# Altium project InvTrifasico.PrjPcb
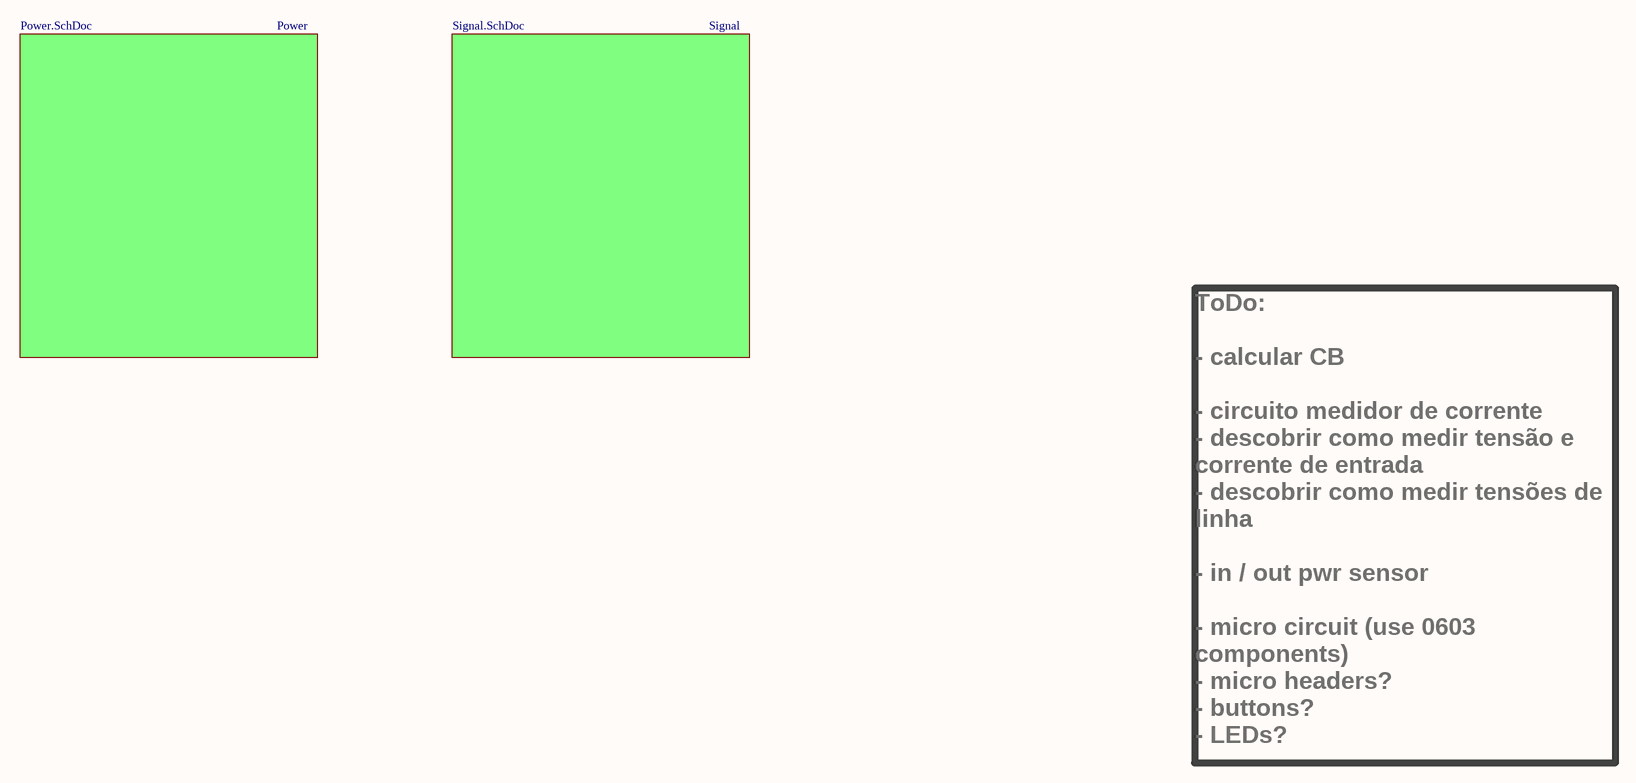
[diagram p0: TopHierarchy.SchDoc]
3 sheets, 79 parts. Net scope: global (net labels, ports and power ports of the same name join across sheets).
Board file: InvTrifasico.PcbDoc
Sheets:
  TopHierarchy.SchDoc
    Power = Power.SchDoc
    Signal = Signal.SchDoc

## Sheet TopHierarchy.SchDoc
size A3

### Sub-sheets
Power = Power.SchDoc: no entries
Signal = Signal.SchDoc: no entries

### Notes on the sheet
- ToDo:
  - calcular CB
  - circuito medidor de corrente
  - descobrir como medir tensão e corrente de entrada
  - descobrir como medir tensões de linha
  - in / out pwr sensor
  - micro circuit (use 0603 components)
  - micro headers?
  - buttons?
  - LEDs?
  - in / out connectors
  - choose heat sink

## Sheet Power.SchDoc
size A3
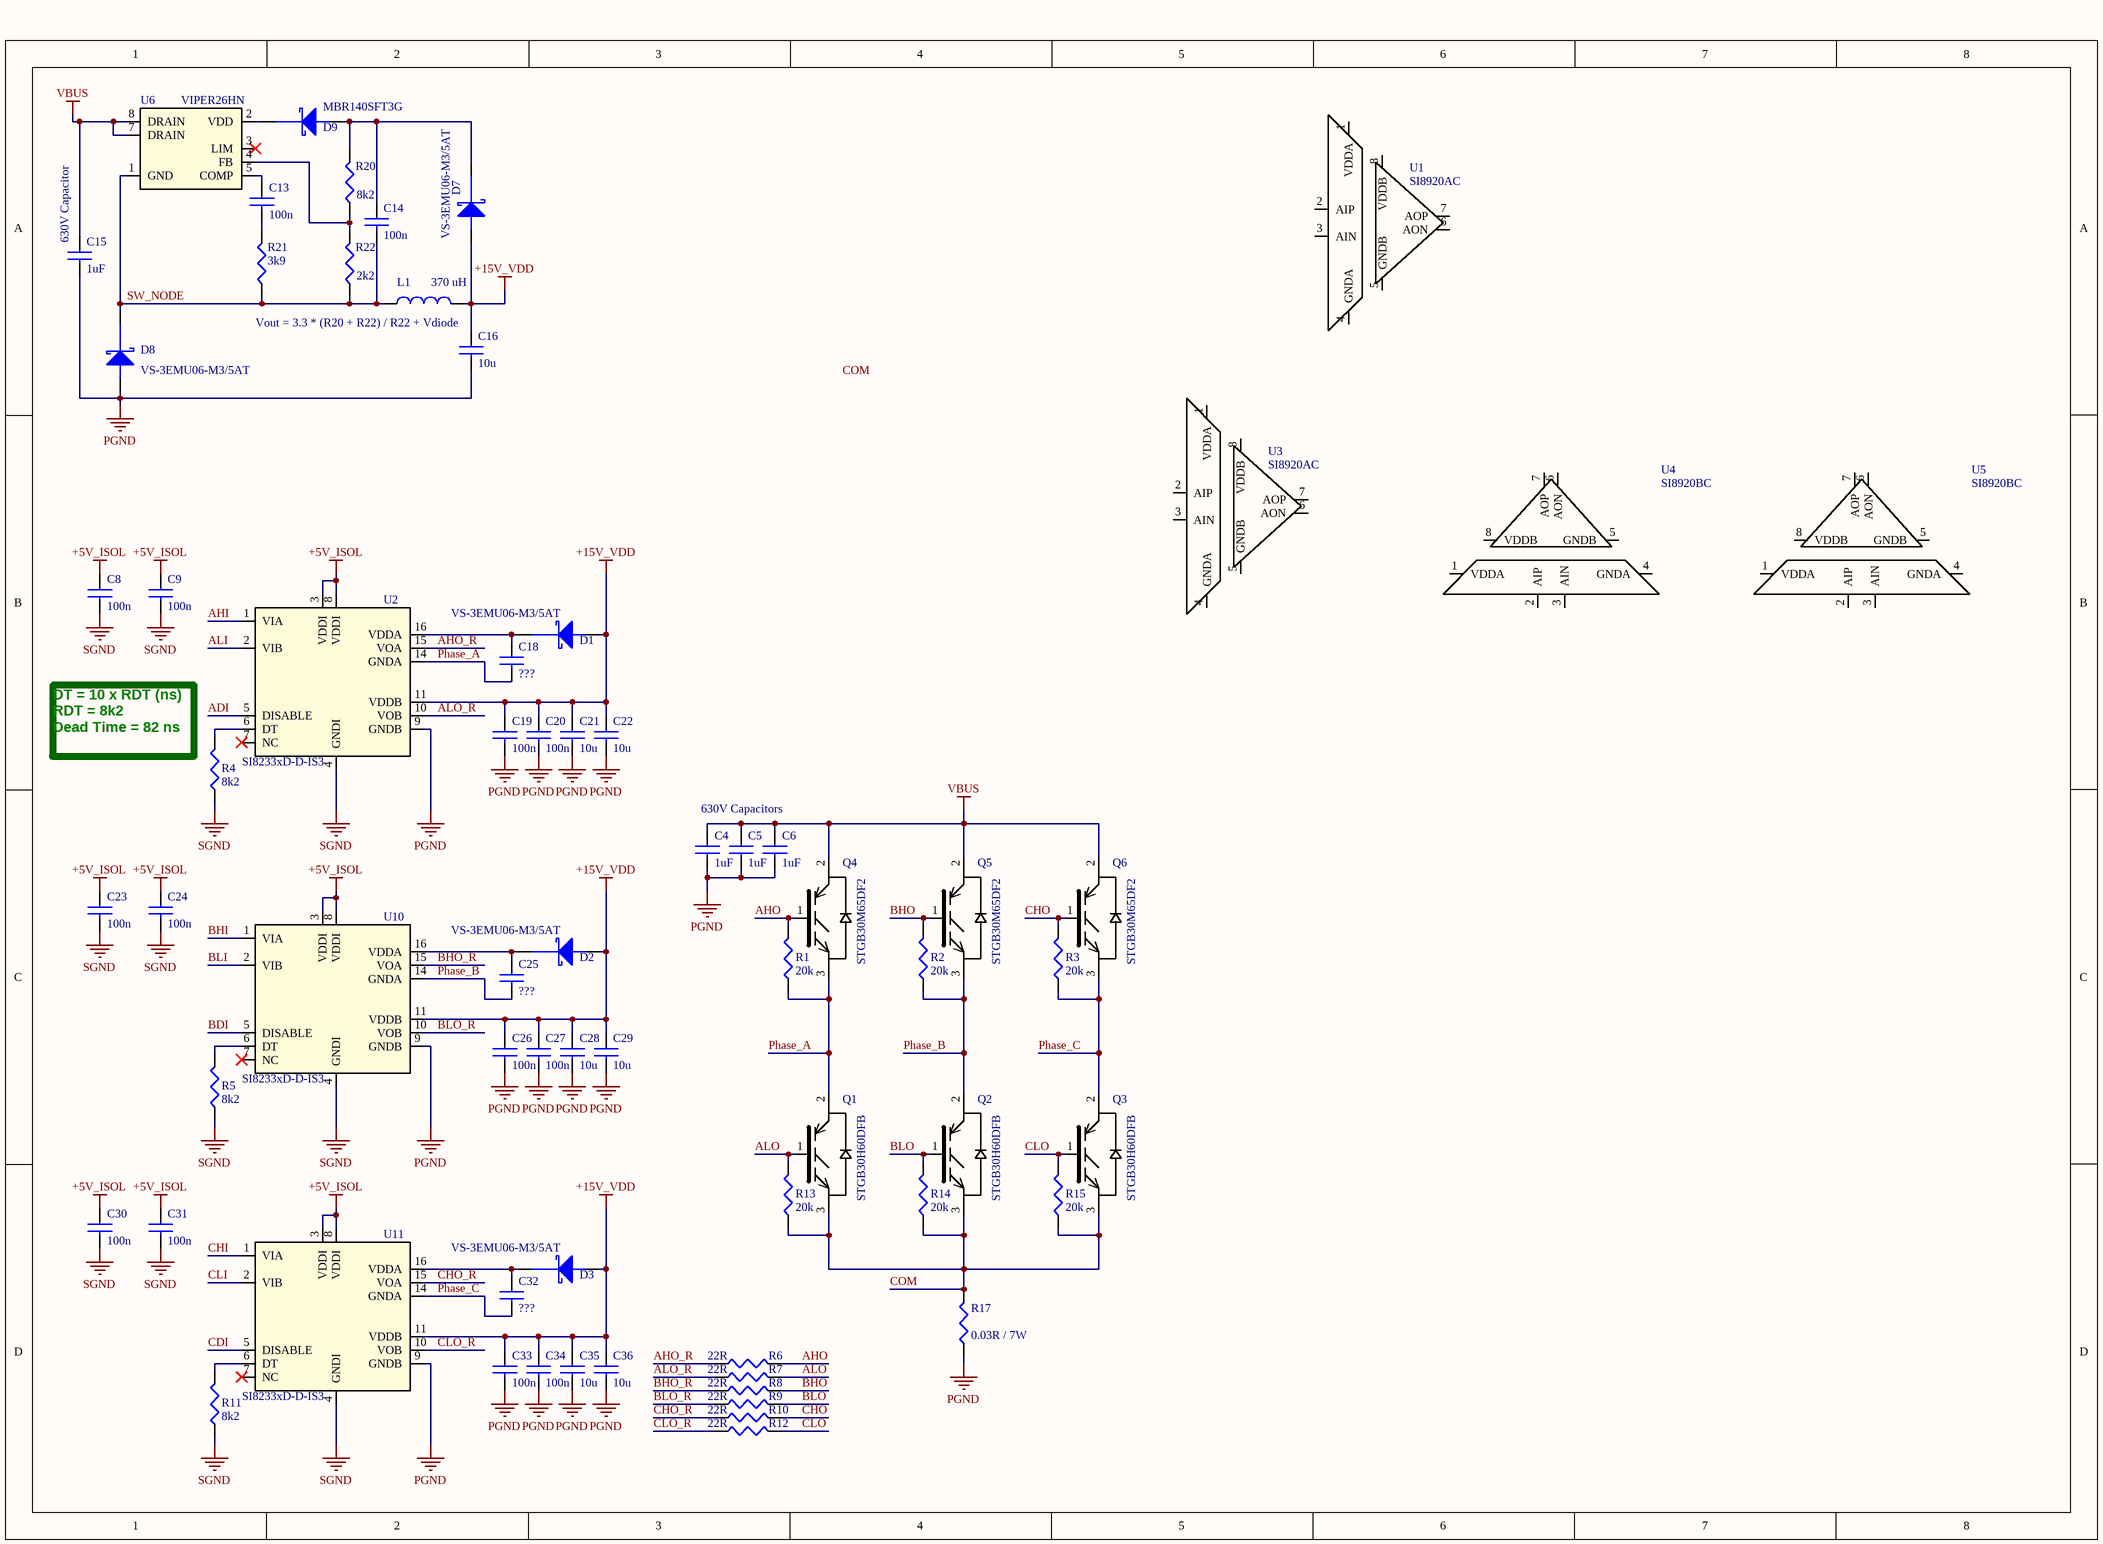
[diagram p1: Power.SchDoc]

### Parts
C4  1uF  [C_HIGH_V]
C5  1uF  [C_HIGH_V]
C6  1uF  [C_HIGH_V]
C8  100n  [C0805]
C9  100n  [C0805]
C13  100n  [C0805]
C14  100n  [C0805]
C15  1uF  [C_HIGH_V]
C16  10u  [C1206]
C18  ???  [C0805]
C19  100n  [C0805]
C20  100n  [C0805]
C21  10u  [C0805]
C22  10u  [C0805]
C23  100n  [C0805]
C24  100n  [C0805]
C25  ???  [C0805]
C26  100n  [C0805]
C27  100n  [C0805]
C28  10u  [C0805]
C29  10u  [C0805]
C30  100n  [C0805]
C31  100n  [C0805]
C32  ???  [C0805]
C33  100n  [C0805]
C34  100n  [C0805]
C35  10u  [C0805]
C36  10u  [C0805]
D1  VS-3EMU06-M3/5AT  [DO-214AC]
D2  VS-3EMU06-M3/5AT  [DO-214AC]
D3  VS-3EMU06-M3/5AT  [DO-214AC]
D7  VS-3EMU06-M3/5AT  [DO-214AC]
D8  VS-3EMU06-M3/5AT  [DO-214AC]
D9  MBR140SFT3G  [SOD-123FL]
L1  370 uH  [IND_370u]
Q1  STGB30H60DFB  [D2PAK]
Q2  STGB30H60DFB  [D2PAK]
Q3  STGB30H60DFB  [D2PAK]
Q4  STGB30M65DF2  [D2PAK]
Q5  STGB30M65DF2  [D2PAK]
Q6  STGB30M65DF2  [D2PAK]
R1  20k  [R0805]
R2  20k  [R0805]
R3  20k  [R0805]
R4  8k2  [R0805]
R5  8k2  [R0805]
R6  22R  [R0805]
R7  22R  [R0805]
R8  22R  [R0805]
R9  22R  [R0805]
R10  22R  [R0805]
R11  8k2  [R0805]
R12  22R  [R0805]
R13  20k  [R0805]
R14  20k  [R0805]
R15  20k  [R0805]
R17  0.03R / 7W  [R2818]
R20  8k2  [R0805]
R21  3k9  [R0805]
R22  2k2  [R0805]
U1  SI8920AC  [8_DIP_SMD]
U2  SI8233xD-D-IS3  [SOIC-16 Wide (14-pins)]
U3  SI8920AC  [8_DIP_SMD]
U4  SI8920BC  [8_DIP_SMD]
U5  SI8920BC  [8_DIP_SMD]
U6  VIPER26HN  [7_DIP]
U10  SI8233xD-D-IS3  [SOIC-16 Wide (14-pins)]
U11  SI8233xD-D-IS3  [SOIC-16 Wide (14-pins)]

### Nets
+5V_ISOL: C8.1 C9.1 C23.1 C24.1 C30.1 C31.1 U2.3(VDDI) U2.8(VDDI) U10.3(VDDI) U10.8(VDDI) U11.3(VDDI) U11.8(VDDI)
+15V_VDD: C16.1 C19.1 C20.1 C21.1 C22.1 C26.1 C27.1 C28.1 C29.1 C33.1 C34.1 C35.1 C36.1 D1.2(Anode) D2.2(Anode) D3.2(Anode) D7.2(Anode) L1.2 U2.11(VDDB) U10.11(VDDB) U11.11(VDDB)
PGND: C4.2 C5.2 C6.2 C15.2 C16.2 C19.2 C20.2 C21.2 C22.2 C26.2 C27.2 C28.2 C29.2 C33.2 C34.2 C35.2 C36.2 D8.2(Anode) R17.1 U2.9(GNDB) U10.9(GNDB) U11.9(GNDB)
SGND: C8.2 C9.2 C23.2 C24.2 C30.2 C31.2 R4.1 R5.1 R11.1 U2.4(GNDI) U10.4(GNDI) U11.4(GNDI)
VBUS: C4.1 C5.1 C6.1 C15.1 Q4.2(DRAIN) Q5.2(DRAIN) Q6.2(DRAIN) U6.7(DRAIN) U6.8(DRAIN)
ADI: U2.5(DISABLE)
AHI: U2.1(VIA)
AHO: Q4.1(GATE) R1.2 R6.2
AHO_R: R6.1 U2.15(VOA)
ALI: U2.2(VIB)
ALO: Q1.1(GATE) R7.2 R13.2
ALO_R: R7.1 U2.10(VOB)
BDI: U10.5(DISABLE)
BHI: U10.1(VIA)
BHO: Q5.1(GATE) R2.2 R8.2
BHO_R: R8.1 U10.15(VOA)
BLI: U10.2(VIB)
BLO: Q2.1(GATE) R9.2 R14.2
BLO_R: R9.1 U10.10(VOB)
CDI: U11.5(DISABLE)
CHI: U11.1(VIA)
CHO: Q6.1(GATE) R3.2 R10.2
CHO_R: R10.1 U11.15(VOA)
CLI: U11.2(VIB)
CLO: Q3.1(GATE) R12.2 R15.2
CLO_R: R12.1 U11.10(VOB)
COM: Q1.3(SOURCE) Q2.3(SOURCE) Q3.3(SOURCE) R13.1 R14.1 R15.1 R17.2
Phase_A: C18.2 Q1.2(DRAIN) Q4.3(SOURCE) R1.1 U2.14(GNDA)
Phase_B: C25.2 Q2.2(DRAIN) Q5.3(SOURCE) R2.1 U10.14(GNDA)
Phase_C: C32.2 Q3.2(DRAIN) Q6.3(SOURCE) R3.1 U11.14(GNDA)
SW_NODE: C14.2 D8.1(Cathode) L1.1 R21.1 R22.1 U6.1(GND)
NetC13_1: C13.1 U6.5(COMP)
NetC13_2: C13.2 R21.2
NetC14_1: C14.1 D7.1(Cathode) D9.2(Anode) R20.2
NetC18_1: C18.1 D1.1(Cathode) U2.16(VDDA)
NetC25_1: C25.1 D2.1(Cathode) U10.16(VDDA)
NetC32_1: C32.1 D3.1(Cathode) U11.16(VDDA)
NetD9_1: D9.1(Cathode) U6.2(VDD)
NetR4_2: R4.2 U2.6(DT)
NetR5_2: R5.2 U10.6(DT)
NetR11_2: R11.2 U11.6(DT)
NetR20_1: R20.1 R22.2 U6.4(FB)

Not connected (* = marked no-connect by the designer): U1 1(VDDA) 2(AIP) 3(AIN) 4(GNDA) 5(GNDB) 6(AON) 7(AOP) 8(VDDB); U2 7(NC)*; U3 1(VDDA) 2(AIP) 3(AIN) 4(GNDA) 5(GNDB) 6(AON) 7(AOP) 8(VDDB); U4 1(VDDA) 2(AIP) 3(AIN) 4(GNDA) 5(GNDB) 6(AON) 7(AOP) 8(VDDB); U5 1(VDDA) 2(AIP) 3(AIN) 4(GNDA) 5(GNDB) 6(AON) 7(AOP) 8(VDDB); U6 3(LIM)*; U10 7(NC)*; U11 7(NC)*

### Notes on the sheet
- (near C15) 630V Capacitor
- Vout = 3.3 * (R20 + R22) / R22 + Vdiode
- (near R4) DT = 10 x RDT (ns)
  RDT = 8k2
  Dead Time = 82 ns
- 630V Capacitors
- Labels drawn without touching a wire or pin: COM

### Library data of the parts
C4-C6 C15 = CAP_HIGH_VOLAGE: CAP CER 1UF 630V X7T STACKED SMD; Manufacturer: Murata Electronics North America; Manufacturer Part Number: KC355TD7LQ105MV01K; Tolerance: ±20%; Supplier 1: Digi-Key; RoHS: RoHS Compliant; Category: Capacitors; Stock 1: 0; Pricing 1: 1000=1.78126 (USD); Packaging: Tape & Reel (TR); Part Status: Active; Voltage - Rated: 630V; Temperature Coefficient: X7T; Operating Temperature: -55°C ~ 125°C; Features: -; Ratings: AEC-Q200; Applications: Automotive; Failure Rate: -; Mounting Type: Surface Mount, MLCC; Package / Case: Stacked SMD, 2 J-Lead; Size / Dimension: 0.240" L x 0.209" W (6.10mm x 5.30mm); Height - Seated (Max): -; Thickness (Max): 0.197" (5.00mm); Lead Spacing: -; Lead Style: J-Lead; ComponentLink1URL: http://search.murata.co.jp/Ceramy/image/img/A01X/G101/ENG/KC355_V01_E.pdf; ComponentLink1Description: http://search.murata.co.jp/Ceramy/image/img/A01X/G101/ENG/KC355_V01_E.pdf; Supplier Part Number 1: KC355TD7LQ105MV01K-ND
C8 C9 C13 C14 C18-C36 = CAP_0805: 0805 Capacitor
C16 = CAP_1206_10u: CAP CER 10UF 35V X5R 1206; Manufacturer: Murata; Tolerance: ±20%; Supplier 1: Arrow; Category: Capacitors; Voltage - Rated: 35V; Temperature Coefficient: X5R; Mounting Type: Surface Mount, MLCC; Operating Temperature: -55°C ~ 85°C; Package / Case: 1206 (3216 Metric); Size/Dimension: 0.126" L x 0.063" W (3.20mm x 1.60mm); Packaging: Tape & Reel (TR); Supplier 2: Digi-Key; Supplier 1 Part Number: GRM319R6YA106MA12D; Supplier 2 Part Number: 490-9965-2-ND
D1-D3 D7 D8 = VS-3EMU06-M3/5AT: DIODE GEN PURP 600V 3A DO214AC; Manufacturer: Vishay Semiconductor Diodes Division; Diode Type: Standard; Speed: Fast Recovery =< 500ns, > 200mA (Io); Supplier 1: Digi-Key; Manufacturer Part Number: VS-3EMU06-M3/5AT; RoHS: RoHS Compliant; Category: Discrete Semiconductor Products; Stock 1: 0; Pricing 1: 1=0.44, 10=0.374, 25=0.3492, 100=0.2795, 250=0.25956, 500=0.21962, 1000=0.1697, 2500=0.15473 (USD); Packaging: Cut Tape (CT); Part Status: Active; Current - Average Rectified (Io): 3A; Capacitance @ Vr, F: -; Mounting Type: Surface Mount; Package / Case: DO-214AC, SMA; Supplier Device Package: DO-214AC (SMA); Operating Temperature - Junction: -55°C ~ 175°C; ComponentLink1URL: http://www.vishay.com/docs/93993/vs-3emu06-m3.pdf; ComponentLink1Description: http://www.vishay.com/docs/93993/vs-3emu06-m3.pdf; Supplier Part Number 1: VS-3EMU06-M3/5ATGICT-ND
D9 = MBR140SFT3G: DIODE SCHOTTKY 550mV @ 1A, 40V, SOD123L; Manufacturer: ON Semiconductor; Manufacturer Part Number: MBR140SFT1G; Current - Reverse Leakage @ Vr: 500µA @ 40V; Supplier 2: Digi-Key; Packaging: Cut Tape (CT); Diode Type: Schottky; Voltage - DC Reverse (Vr) (Max): 40V; Current - Average Rectified (Io): 1A; Voltage - Forward (Vf) (Max) @ If: 550mV @ 1A; Mounting Type: Surface Mount; Package / Case: SOD-123F; Supplier Device Package: SOD-123L; Operating Temperature - Junction: -55°C ~ 125°C; Supplier 2 Part Number: MBR140SFT1GOSDKR-ND; Supplier 1: Arrow; Supplier 1 Part Number: MBR140SFT3G
L1 = IND_370u: 390µH Shielded Wirewound Inductor 1.6A 680 mOhm Max Nonstandard; Manufacturer: Bourns Inc.; Manufacturer Part Number: PM127SH-391M-RC; Material - Core: Ferrite; Tolerance: ±20%; Q @ Freq: 20 @ 796kHz; Supplier 1: Digi-Key; RoHS: RoHS Compliant; Category: Inductors, Coils, Chokes; Stock 1: 0; Pricing 1: 400=0.62475 (USD); Packaging: Tape & Reel (TR); Part Status: Active; Type: Wirewound; Shielding: Shielded; DC Resistance (DCR): 680 mOhm Max; Ratings: -; Operating Temperature: -40°C ~ 125°C; Mounting Type: Surface Mount; Package / Case: Nonstandard; Supplier Device Package: -; Size / Dimension: 0.492" L x 0.492" W (12.50mm x 12.50mm); Height - Seated (Max): 0.315" (8.00mm); ComponentLink1URL: http://www.bourns.com/docs/Product-Datasheets/PM127SH_SERIES.pdf; ComponentLink1Description: http://www.bourns.com/docs/Product-Datasheets/PM127SH_SERIES.pdf; Supplier Part Number 1: PM127SH-391M-RC-ND
Q1-Q3 = STGB30H60DFB: TRENCH GATE FIELD-STOP IGBT, HB; Manufacturer: STMicroelectronics; IGBT Type: Trench Field Stop; Vce(on) (Max) @ Vge, Ic: 2V @ 15V, 30A; Switching Energy: 383µJ (on), 293µJ (off); Input Type: Standard; Td (on/off) @ 25°C: 37ns/146ns; Test Condition: 400V, 30A, 10 Ohm, 15V; Supplier 1: Digi-Key; Manufacturer Part Number: STGB30H60DFB; RoHS: RoHS Compliant; Category: Discrete Semiconductor Products; Stock 1: 0; Pricing 1: 1=2.81, 10=2.538, 100=2.0394, 500=1.5862 (USD); Packaging: Cut Tape (CT); Part Status: Active; Operating Temperature: -55°C ~ 175°C (TJ); Mounting Type: Surface Mount; Package / Case: TO-263-3, D²Pak (2 Leads + Tab), TO-263AB; Supplier Device Package: D2PAK; ComponentLink1URL: http://www.st.com/content/ccc/resource/technical/document/datasheet/56/6d/c4/33/3a/aa/4a/fc/DM00125119.pdf/files/DM00125119.pdf/jcr:content/translations/en.DM00125119.pdf; ComponentLink1Description: http://www.st.com/content/ccc/resource/technical/document/datasheet/56/6d/c4/33/3a/aa/4a/fc/DM00125119.pdf/files/DM00125119.pdf/jcr:content/translations/en.DM00125119.pdf; Supplier Part Number 1: 497-16518-1-ND
Q4-Q6 = STGB30M65DF2: IGBT 650V 30A D2PAK; Manufacturer: STMicroelectronics; IGBT Type: Trench Field Stop; Vce(on) (Max) @ Vge, Ic: 2V @ 15V, 30A; Switching Energy: 300µJ (on), 960µJ (off); Input Type: Standard; Td (on/off) @ 25°C: 31.6ns/115ns; Test Condition: 400V, 30A, 10 Ohm, 15V; Supplier 1: Digi-Key; Manufacturer Part Number: STGB30M65DF2; RoHS: RoHS Compliant; Category: Discrete Semiconductor Products; Stock 1: 1013; Pricing 1: 1=4.1, 10=3.681, 100=3.0158, 500=2.56726 (USD); Packaging: Cut Tape (CT); Part Status: Active; Operating Temperature: -55°C ~ 175°C (TJ); Mounting Type: Surface Mount; Package / Case: TO-263-3, D²Pak (2 Leads + Tab), TO-263AB; Supplier Device Package: D2PAK; ComponentLink1URL: http://www.st.com/content/ccc/resource/technical/document/datasheet/f7/d5/65/0d/e4/ad/41/57/DM00157913.pdf/files/DM00157913.pdf/jcr:content/translations/en.DM00157913.pdf; ComponentLink1Description: http://www.st.com/content/ccc/resource/technical/document/datasheet/f7/d5/65/0d/e4/ad/41/57/DM00157913.pdf/files/DM00157913.pdf/jcr:content/translations/en.DM00157913.pdf; Supplier Part Number 1: 497-15843-1-ND
R1-R15 R20-R22 = RES_0805
R17 = res_2818: RES 0.003 OHM 1% 7W 2818; Manufacturer: Vishay Dale; Manufacturer Part Number: WSHM28183L000FEA; Temperature Coefficient: ±200ppm/°C; Supplier 1: Digi-Key; RoHS: RoHS Compliant; Category: Resistors; Stock 1: 954; Pricing 1: 1=1.86, 10=1.652, 25=1.5316, 50=1.4414, 100=1.2613, 250=1.08108, 500=0.9009, 1000=0.78078 (USD); Packaging: Cut Tape (CT); Part Status: Active; Tolerance: ±1%; Power (Watts): 7W; Composition: Metal Element; Features: Automotive AEC-Q200, Current Sense, Moisture Resistant, Pulse Withstanding; Operating Temperature: -65°C ~ 170°C; Package / Case: Nonstandard; Supplier Device Package: 2818; Size / Dimension: 0.280" L x 0.181" W (7.10mm x 4.60mm); Height - Seated (Max): 0.069" (1.75mm); Failure Rate: -; ComponentLink1URL: http://www.vishay.com/docs/30188/wshm2818.pdf; ComponentLink1Description: http://www.vishay.com/docs/30188/wshm2818.pdf; Supplier Part Number 1: 541-2619-1-ND
U1 U3 = SI8920AC: IC OP AMP ISOLATION 8DIP-GW; Manufacturer: Silicon Labs; Manufacturer Part Number: SI8920AC-IP; Output Type: Differential; Current - Supply: 4.2mA; Voltage - Supply, Single/Dual (±): 3 V ~ 5.5 V; Supplier 1: Digi-Key; RoHS: RoHS Compliant; Category: Integrated Circuits (ICs); Stock 1: 595; Pricing 1: 1=3.51, 25=3.3844, 100=3.2544, 1000=3.19789 (USD); Packaging: Tube; Part Status: Active; Amplifier Type: Isolation; Slew Rate: -; Operating Temperature: -40°C ~ 125°C; Mounting Type: Surface Mount; Package / Case: 8-SMD, Gull Wing; Supplier Device Package: 8-DIP Gull Wing; ComponentLink1URL: http://www.silabs.com/documents/public/data-sheets/si8920-datasheet.pdf; ComponentLink1Description: http://www.silabs.com/documents/public/data-sheets/si8920-datasheet.pdf; Supplier Part Number 1: 336-3328-5-ND
U2 U10 U11 = SI8233xD-D-IS3: ISOLATED GATE DRIVER, 8 MM CREEP; Manufacturer: Silicon Labs; Manufacturer Part Number: SI8233AD-D-IS3; Voltage - Isolation: 5000Vrms; Common Mode Transient Immunity (Min): 45kV/µs; Propagation Delay tpLH / tpHL (Max): 60ns, 60ns; Pulse Width Distortion (Max): 5.6ns; Rise / Fall Time (Typ): 12ns, 12ns; Current - Output High, Low: 2A, 4A; Current - Peak Output: 4A; Voltage - Supply: 6.5 V ~ 24 V; Approvals: CQC, CSA, UR, VDE; Supplier 1: Digi-Key; Supplier Part Number 1: 336-4258-ND; RoHS: RoHS Compliant; Category: Isolators; Stock 1: 76; Pricing 1: 1=3.37, 25=3.2436, 100=3.1188, 1000=2.8125 (USD); Packaging: Tube; Part Status: Active; Technology: Capacitive Coupling; Voltage - Forward (Vf) (Typ): -; Operating Temperature: -40°C ~ 125°C; Mounting Type: Surface Mount; Package / Case: 14-SOIC (0.295", 7.50mm Width); Supplier Device Package: 14-SOIC; ComponentLink1URL: https://www.silabs.com/documents/public/data-sheets/Si823x.pdf; ComponentLink1Description: https://www.silabs.com/documents/public/data-sheets/Si823x.pdf
U4 U5 = SI8920BC: IC OP AMP ISOLATION 8DIP-GW; Manufacturer: Silicon Labs; Manufacturer Part Number: SI8920BC-IP; Output Type: Differential; Current - Supply: 4.2mA; Voltage - Supply, Single/Dual (±): 3 V ~ 5.5 V; Supplier 1: Digi-Key; RoHS: RoHS Compliant; Category: Integrated Circuits (ICs); Stock 1: 3602; Pricing 1: 1=2.93, 25=2.8204, 100=2.712, 1000=2.65553 (USD); Packaging: Tube; Part Status: Active; Amplifier Type: Isolation; Slew Rate: -; Operating Temperature: -40°C ~ 125°C; Mounting Type: Surface Mount; Package / Case: 8-SMD, Gull Wing; Supplier Device Package: 8-DIP Gull Wing; ComponentLink1URL: http://www.silabs.com/documents/public/data-sheets/si8920-datasheet.pdf; ComponentLink1Description: http://www.silabs.com/documents/public/data-sheets/si8920-datasheet.pdf; Supplier Part Number 1: 336-3329-5-ND
U6 = VIPER26HN: IC OFFLINE CONV PWM 800V 7-DIP; Manufacturer: STMicroelectronics; Output Isolation: Either; Internal Switch(s): Yes; Topology: Flyback; Voltage - Supply (Vcc/Vdd): 11.5 V ~ 23.5 V; Duty Cycle: 70%; Frequency - Switching: 115kHz; Fault Protection: Current Limiting, Over Temperature; Supplier 1: Digi-Key; Manufacturer Part Number: VIPER26HN; RoHS: RoHS Compliant; Category: Integrated Circuits (ICs); Stock 1: 2903; Pricing 1: 1=1.1, 10=0.979, 100=0.7636, 500=0.6308, 1000=0.498 (USD); Packaging: Tube; Part Status: Active; Voltage - Breakdown: 800V; Control Features: -; Operating Temperature: -40°C ~ 150°C (TJ); Package / Case: 8-DIP (0.300", 7.62mm), 7 Leads; Supplier Device Package: 7-DIP; Mounting Type: Through Hole; Base Part Number: VIPER26; ComponentLink1URL: http://www.st.com/content/ccc/resource/technical/document/datasheet/cd/d4/93/15/03/e1/40/81/CD00279018.pdf/files/CD00279018.pdf/_jcr_content/translations/en.CD00279018.pdf; ComponentLink1Description: http://www.st.com/content/ccc/resource/technical/document/datasheet/cd/d4/93/15/03/e1/40/81/CD00279018.pdf/files/CD00279018.pdf/_jcr_content/translations/en.CD00279018.pdf; Supplier Part Number 1: 497-10743-5-ND

## Sheet Signal.SchDoc
size A3
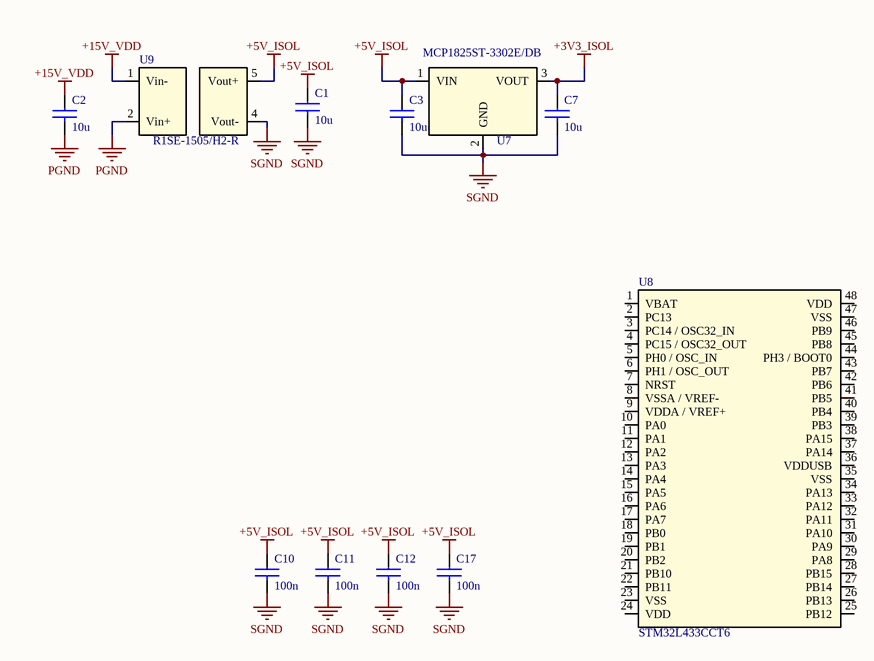
[diagram p2: Signal.SchDoc]

### Parts
C1  10u  [C0805]
C2  10u  [C1206]
C3  10u  [C0805]
C7  10u  [C0805]
C10  100n  [C0805]
C11  100n  [C0805]
C12  100n  [C0805]
C17  100n  [C0805]
U7  MCP1825ST-3302E/DB  [SOT-223-3]
U8  STM32L433CCT6  [LQFP-48]
U9  R1SE-1505/H2-R  [R1SE-1505/H2-R]

### Nets
+3V3_ISOL: C7.1 U7.3(VOUT)
+5V_ISOL: C1.1 C3.1 C10.1 C11.1 C12.1 C17.1 U7.1(VIN) U9.5(Vout+)
+15V_VDD: C2.1 U9.1(Vin-)
PGND: C2.2 U9.2(Vin+)
SGND: C1.2 C3.2 C7.2 C10.2 C11.2 C12.2 C17.2 U7.2(GND) U9.4(Vout-)

Not connected (* = marked no-connect by the designer): U8 1(VBAT) 2(PC13) 3(PC14_/_OSC32_IN) 4(PC15_/_OSC32_OUT) 5(PH0_/_OSC_IN) 6(PH1_/_OSC_OUT) 7(NRST) 8(VSSA_/_VREF-) 9(VDDA_/_VREF+) 10(PA0) 11(PA1) 12(PA2) 13(PA3) 14(PA4) 15(PA5) 16(PA6) 17(PA7) 18(PB0) 19(PB1) 20(PB2) 21(PB10) 22(PB11) 23(VSS) 24(VDD) 25(PB12) 26(PB13) 27(PB14) 28(PB15) 29(PA8) 30(PA9) 31(PA10) 32(PA11) 33(PA12) 34(PA13) 35(VSS) 36(VDDUSB) 37(PA14) 38(PA15) 39(PB3) 40(PB4) 41(PB5) 42(PB6) 43(PB7) 44(PH3_/_BOOT0) 45(PB8) 46(PB9) 47(VSS) 48(VDD); U9 8(NC)

### Library data of the parts
C1 C3 C7 C10-C12 C17 = CAP_0805: 0805 Capacitor
C2 = CAP_1206_10u: as C16 on sheet Power; Supplier 1: Arrow; Category: Capacitors; Voltage - Rated: 35V; Temperature Coefficient: X5R; Mounting Type: Surface Mount, MLCC; Operating Temperature: -55°C ~ 85°C; Package / Case: 1206 (3216 Metric); Size/Dimension: 0.126" L x 0.063" W (3.20mm x 1.60mm); Packaging: Tape & Reel (TR); Supplier 2: Digi-Key; Supplier 1 Part Number: GRM319R6YA106MA12D; Supplier 2 Part Number: 490-9965-2-ND
U7 = MCP1825ST-3302E/DB: IC REG LIN 3.3V 500MA SOT223-3; Manufacturer: Microchip Technology; Manufacturer Part Number: MCP1825S-3302E/DB; Output Configuration: Positive; Output Type: Fixed; Voltage - Input (Max): 6V; Voltage Dropout (Max): 0.35V @ 500mA; PSRR: 60dB (100Hz); Protection Features: Over Temperature, Short Circuit, Under Voltage Lockout (UVLO); Supplier 1: Digi-Key; RoHS: RoHS Compliant; Category: Integrated Circuits (ICs); Stock 1: 7442; Pricing 1: 1=0.54, 25=0.456, 100=0.4134 (USD); Packaging: Tube; Part Status: Active; Voltage - Output (Min/Fixed): 3.3V; Voltage - Output (Max): -; Current - Output: 500mA; Control Features: -; Operating Temperature: -40°C ~ 125°C; Mounting Type: Surface Mount; Package / Case: TO-261-4, TO-261AA; Supplier Device Package: SOT-223-3; Base Part Number: MCP1825S; ComponentLink1URL: http://www.microchip.com/mymicrochip/filehandler.aspx?ddocname=en531698; ComponentLink1Description: http://www.microchip.com/mymicrochip/filehandler.aspx?ddocname=en531698; Supplier Part Number 1: MCP1825S-3302E/DB-ND
U8 = STM32L433CCT6: IC MCU 32BIT 256KB FLASH 48LQFP; Manufacturer: STMicroelectronics; Core Processor: ARM® Cortex®-M4; Core Size: 32-Bit; Speed: 80MHz; Connectivity: CAN, I²C, IrDA, LIN, MMC/SD, QSPI, SAI, SPI, SWPMI, UART/USART, USB; Peripherals: Brown-out Detect/Reset, DMA, LCD, PWM, WDT; Program Memory Size: 256KB (256K x 8); RAM Size: 64K x 8; Voltage - Supply (Vcc/Vdd): 1.71 V ~ 3.6 V; Data Converters: A/D 10x12b, D/A 2x12b; Oscillator Type: Internal; Supplier 1: Digi-Key; Manufacturer Part Number: STM32L433CCT6; RoHS: RoHS Compliant; Category: Integrated Circuits (ICs); Stock 1: 0; Pricing 1: 1=5.85, 10=5.25, 100=4.3017, 500=3.66196, 1000=3.0884 (USD); Packaging: Tray; Part Status: Active; Program Memory Type: FLASH; EEPROM Size: -; Operating Temperature: -40°C ~ 85°C (TA); Package / Case: 48-LQFP; Supplier Device Package: 48-LQFP (7x7); ComponentLink1URL: http://www.st.com/content/ccc/resource/technical/document/datasheet/f7/a0/fc/27/24/4e/4f/3f/DM00257192.pdf/files/DM00257192.pdf/jcr:content/translations/en.DM00257192.pdf; ComponentLink1Description: http://www.st.com/content/ccc/resource/technical/document/datasheet/f7/a0/fc/27/24/4e/4f/3f/DM00257192.pdf/files/DM00257192.pdf/jcr:content/translations/en.DM00257192.pdf; Supplier Part Number 1: 497-16579-ND
U9 = R1SE-1505/H2-R: CONV DC/DC 1W 15VIN 05VOUT; Manufacturer: Recom Power; Voltage - Input (Min): 13.5V; Voltage - Input (Max): 16.5V; Voltage - Output 1: 5V; Current - Output (Max): 200mA; Efficiency: 74%; Supplier 1: Digi-Key; Manufacturer Part Number: R1SE-1505/H2-R; RoHS: RoHS Compliant; Category: Power Supplies - Board Mount; Stock 1: 508; Pricing 1: 1=3.86, 5=3.802, 10=3.749, 25=3.642, 50=3.4278, 100=3.3207, 250=3.2136 (USD); Packaging: Cut Tape (CT); Part Status: Active; Type: Isolated Module; Voltage - Output 2: -; Voltage - Output 3: -; Applications: ITE (Commercial); Features: -; Operating Temperature: -40°C ~ 100°C; Mounting Type: Surface Mount; Package / Case: 8-SMD Module, 5 Leads; Size / Dimension: 0.50" L x 0.42" W x 0.26" H (12.8mm x 10.7mm x 6.7mm); ComponentLink1URL: https://www.recom-power.com/pdf/Econoline/R1SE_H2.pdf; ComponentLink1Description: https://www.recom-power.com/pdf/Econoline/R1SE_H2.pdf; Supplier Part Number 1: 945-2276-1-ND

## Nets that join several sheets
+5V_ISOL: Power (12 pins), Signal (8 pins)
+15V_VDD: Power (21 pins), Signal (C2.1 U9.1)
PGND: Power (22 pins), Signal (C2.2 U9.2)
SGND: Power (12 pins), Signal (9 pins)